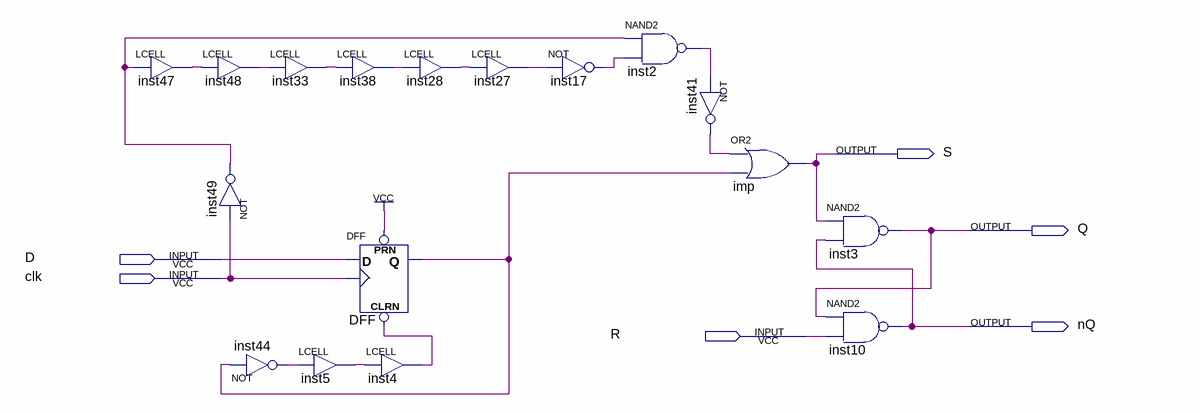
[diagram p0: schematic sheet]
// Quartus schematic t7.bdf as structural Verilog: 17 symbols, 6 pins
module t7 (
  input  D,
  input  clk,
  input  R,
  output S,
  output Q,
  output nQ
);

  wire DFF_q, inst2_out, inst4_out, inst5_out, inst17_out, inst27_out, inst28_out, inst33_out, inst38_out,
       inst41_out, inst44_out, inst47_out, inst48_out, inst49_out;

  LCELL inst47 (.IN(inst49_out), .OUT(inst47_out));
  LCELL inst48 (.IN(inst47_out), .OUT(inst48_out));
  not inst49 (inst49_out, clk);
  LCELL inst33 (.IN(inst48_out), .OUT(inst33_out));
  not inst44 (inst44_out, DFF_q);
  LCELL inst38 (.IN(inst33_out), .OUT(inst38_out));
  DFF DFF (.CLRN(inst4_out), .CLK(clk), .D(D), .PRN(1'b1), .Q(DFF_q));
  LCELL inst4 (.IN(inst5_out), .OUT(inst4_out));
  LCELL inst5 (.IN(inst44_out), .OUT(inst5_out));
  LCELL inst28 (.IN(inst38_out), .OUT(inst28_out));
  LCELL inst27 (.IN(inst28_out), .OUT(inst27_out));
  not inst17 (inst17_out, inst27_out);
  nand inst2 (inst2_out, inst49_out, inst17_out);
  not inst41 (inst41_out, inst2_out);
  or imp (S, inst41_out, DFF_q);
  nand inst3 (Q, S, nQ);
  nand inst10 (nQ, Q, R);
endmodule
